# EAGLE design FT232RL_REEL (EAGLE 9.4.2)
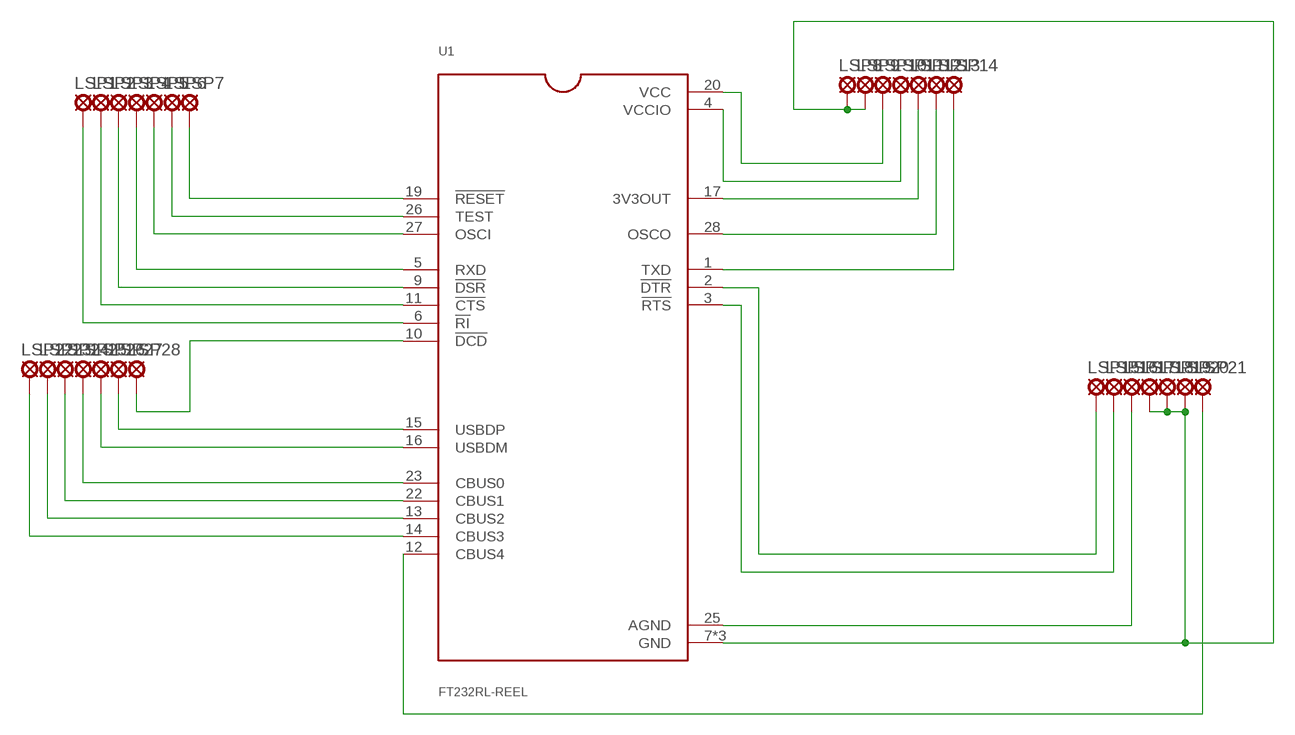
[diagram p0: schematic, sheet 1]

## Parts
LSP1  LSP10_CLSP10_C  [LSP10_C]
LSP2  LSP10_CLSP10_C  [LSP10_C]
LSP3  LSP10_CLSP10_C  [LSP10_C]
LSP4  LSP10_CLSP10_C  [LSP10_C]
LSP5  LSP10_CLSP10_C  [LSP10_C]
LSP6  LSP10_CLSP10_C  [LSP10_C]
LSP7  LSP10_CLSP10_C  [LSP10_C]
LSP8  LSP10_CLSP10_C  [LSP10_C]
LSP9  LSP10_CLSP10_C  [LSP10_C]
LSP10  LSP10_CLSP10_C  [LSP10_C]
LSP11  LSP10_CLSP10_C  [LSP10_C]
LSP12  LSP10_CLSP10_C  [LSP10_C]
LSP13  LSP10_CLSP10_C  [LSP10_C]
LSP14  LSP10_CLSP10_C  [LSP10_C]
LSP15  LSP10_CLSP10_C  [LSP10_C]
LSP16  LSP10_CLSP10_C  [LSP10_C]
LSP17  LSP10_CLSP10_C  [LSP10_C]
LSP18  LSP10_CLSP10_C  [LSP10_C]
LSP19  LSP10_CLSP10_C  [LSP10_C]
LSP20  LSP10_CLSP10_C  [LSP10_C]
LSP21  LSP10_CLSP10_C  [LSP10_C]
LSP22  LSP10_CLSP10_C  [LSP10_C]
LSP23  LSP10_CLSP10_C  [LSP10_C]
LSP24  LSP10_CLSP10_C  [LSP10_C]
LSP25  LSP10_CLSP10_C  [LSP10_C]
LSP26  LSP10_CLSP10_C  [LSP10_C]
LSP27  LSP10_CLSP10_C  [LSP10_C]
LSP28  LSP10_CLSP10_C  [LSP10_C]
U1  FT232RL-REEL  [SOP65P780X200-28N]

## Nets
N$1: LSP7.P$1(MP) U1.19(!RESET)
N$2: LSP6.P$1(MP) U1.26(TEST)
N$3: LSP5.P$1(MP) U1.27(OSCI)
N$4: LSP4.P$1(MP) U1.5(RXD)
N$5: LSP3.P$1(MP) U1.9(!DSR)
N$6: LSP2.P$1(MP) U1.11(!CTS)
N$7: LSP1.P$1(MP) U1.6(!RI)
N$8: LSP28.P$1(MP) U1.10(!DCD)
N$9: LSP27.P$1(MP) U1.15(USBDP)
N$10: LSP26.P$1(MP) U1.16(USBDM)
N$11: LSP25.P$1(MP) U1.23(CBUS0)
N$12: LSP24.P$1(MP) U1.22(CBUS1)
N$13: LSP23.P$1(MP) U1.13(CBUS2)
N$14: LSP22.P$1(MP) U1.14(CBUS3)
N$15: LSP21.P$1(MP) U1.12(CBUS4)
N$16: LSP8.P$1(MP) LSP9.P$1(MP) LSP18.P$1(MP) LSP19.P$1(MP) LSP20.P$1(MP) U1.7(GND) U1.18(GND) U1.21(GND)
N$17: LSP17.P$1(MP) U1.25(AGND)
N$18: LSP16.P$1(MP) U1.3(!RTS)
N$19: LSP15.P$1(MP) U1.2(!DTR)
N$20: LSP14.P$1(MP) U1.1(TXD)
N$21: LSP13.P$1(MP) U1.28(OSCO)
N$22: LSP12.P$1(MP) U1.17(3V3OUT)
N$23: LSP11.P$1(MP) U1.4(VCCIO)
N$24: LSP10.P$1(MP) U1.20(VCC)

## Library data of the parts
LSP1-LSP28 = tbtaco-solpad:LSP10_C: SOLDER PAD drill 1.0 mm, distributor Buerklin, 12H555
U1 = FT232RL-REEL:FT232RL-REEL: USB to serial UART interface; DESCRIPTION: USB Full Speed to Serial UART IC, Includes Oscillator and EEPROM - SSOP-28; DIGI-KEY_PART_NUMBER: 768-1007-1-ND; DIGI-KEY_PURCHASE_URL: https://www.digikey.com/product-detail/en/ftdi-future-technology-devices-international-ltd/FT232RL-REEL/768-1007-1-ND/1836402?utm_source=snapeda&utm_medium=aggregator&utm_campaign=symbol; MF: FTDI,; MP: FT232RL-REEL; PACKAGE: SSOP-28 FTDI

## Board
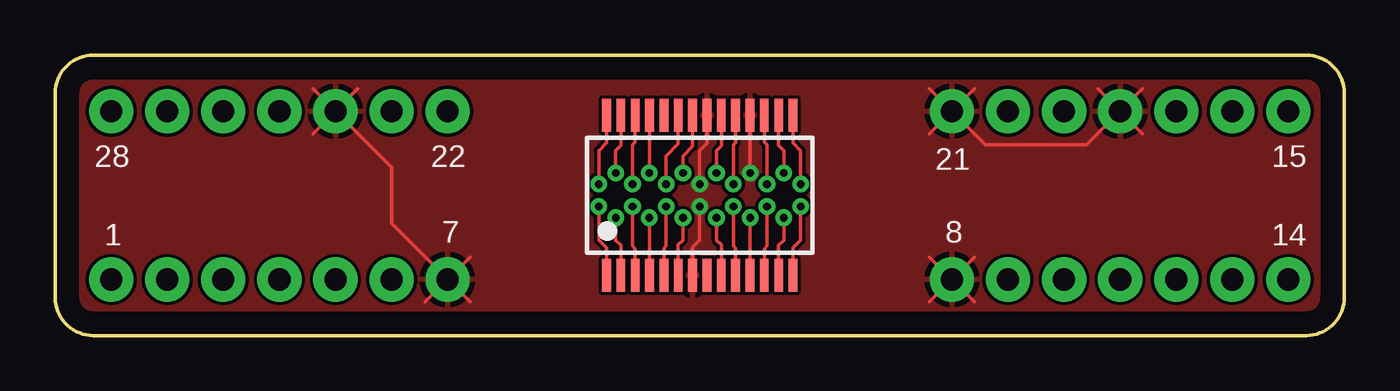
[diagram p1: board, top side]
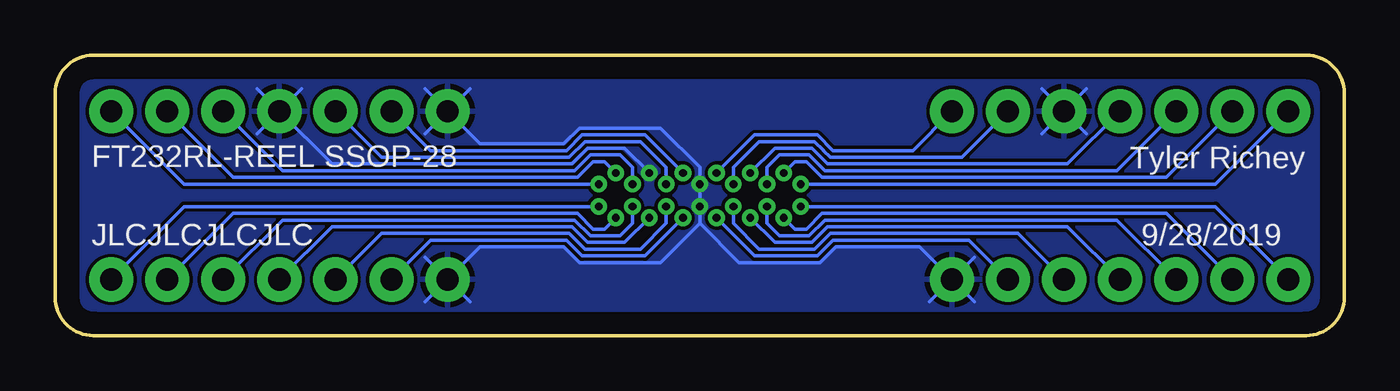
[diagram p2: board, bottom side, seen from below]

Size 58.42 x 12.7 mm. Coordinates in mm from the lower left corner, seen from the top.
Outline: 0,1.73 0,10.97 arc-90 1.73,12.7 56.69,12.7 arc-90 58.42,10.97 58.42,1.73 arc-90 56.69,0 1.73,0 arc-90 0,1.73
Copper layers (1*16): Top 0.035mm / dielectric 1.5mm / Bottom 0.035mm
Design rules "default": minimum track width 6mil, minimum drill 0.35mm, track to track 6mil, track to pad 6mil, pad to pad 6mil, via to via 6mil, smd to smd 6mil, copper to edge 40mil, drill to drill 6mil, minimum pad ring 10mil, minimum via ring 8mil, stop-mask expansion 4mil, vias tented up to drill 0mil, thermal gap 10mil

### Footprints (pad centres in the part's own frame; a part is rotated, then mirrored left to right if it is on the bottom)
LSP10_C = drill 1 pad 2: P$1 0,0
SOP65P780X200-28N = smd 1.5 x 0.4: 1 -3.625,4.225; 2 -3.625,3.575; 3 -3.625,2.925; 4 -3.625,2.275; 5 -3.625,1.625; 6 -3.625,0.975; 7 -3.625,0.325; 8 -3.625,-0.325; 9 -3.625,-0.975; 10 -3.625,-1.625; 11 -3.625,-2.275; 12 -3.625,-2.925; 13 -3.625,-3.575; 14 -3.625,-4.225; 15 3.625,-4.225; 16 3.625,-3.575; 17 3.625,-2.925; 18 3.625,-2.275; 19 3.625,-1.625; 20 3.625,-0.975; 21 3.625,-0.325; 22 3.625,0.325; 23 3.625,0.975; 24 3.625,1.625; 25 3.625,2.275; 26 3.625,2.925; 27 3.625,3.575; 28 3.625,4.225

### Placement (x,y rotation side)
LSP1  15.24,2.54 0 top
LSP2  48.26,2.54 0 top
LSP3  43.18,2.54 0 top
LSP4  12.7,2.54 0 top
LSP5  5.08,10.16 0 top
LSP6  7.62,10.16 0 top
LSP7  45.72,10.16 0 top
LSP8  12.7,10.16 0 top
LSP9  17.78,2.54 0 top
LSP10  43.18,10.16 0 top
LSP11  10.16,2.54 0 top
LSP12  50.8,10.16 0 top
LSP13  2.54,10.16 0 top
LSP14  2.54,2.54 0 top
LSP15  5.08,2.54 0 top
LSP16  7.62,2.54 0 top
LSP17  10.16,10.16 0 top
LSP18  48.26,10.16 0 top
LSP19  40.64,10.16 0 top
LSP20  40.64,2.54 0 top
LSP21  50.8,2.54 0 top
LSP22  55.88,2.54 0 top
LSP23  53.34,2.54 0 top
LSP24  17.78,10.16 0 top
LSP25  15.24,10.16 0 top
LSP26  53.34,10.16 0 top
LSP27  55.88,10.16 0 top
LSP28  45.72,2.54 0 top
U1  29.21,6.35 90 top

### Tracks (layer width: path | path; a pad name or v marks a point on that pad's centre or on a via)
N$1  (via drill 0.35)
  Top 0.152: U1.19 30.83,8.74 30.73,8.64 v30.73,6.86
  Bottom 0.152: v30.73,6.86 30.73,7.62 31.9,8.79 34.41,8.79 35.13,8.08 43.64,8.08 LSP7.P$1
N$2  (via drill 0.35)
  Top 0.152: U1.26 26.29,8.76 26.16,8.64 v26.16,6.86
  Bottom 0.152: LSP6.P$1 10.31,7.47 21.08,7.47 21.34,7.47 23.55,7.47 24.26,8.18 25.6,8.18 26.16,7.62 v26.16,6.86
N$3  (via drill 0.35)
  Top 0.152: U1.27 25.64,8.62 25.4,8.38 v25.4,7.37
  Bottom 0.152: LSP5.P$1 8.08,7.16 23.67,7.16 24.38,7.87 24.89,7.87 v25.4,7.37
N$4  (via drill 0.35)
  Top 0.152: U1.5 27.58,3.96 27.69,4.06 v27.69,5.84
  Bottom 0.152: LSP4.P$1 14.78,4.62 23.29,4.62 24,3.91 26.52,3.91 27.69,5.08 v27.69,5.84
N$5  (via drill 0.35)
  Top 0.152: U1.9 30.18,4.11 29.97,4.32 v29.97,5.33
  Bottom 0.152: v29.97,5.33 31.7,3.61 34.54,3.61 35.25,4.32 41.4,4.32 LSP3.P$1
N$6  (via drill 0.35)
  Top 0.152: U1.11 31.48,4.05 31.5,4.06 v31.5,5.33
  Bottom 0.152: v31.5,5.33 32.61,4.22 34.29,4.22 35,4.93 45.87,4.93 LSP2.P$1
N$7  (via drill 0.35)
  Top 0.152: U1.6 28.23,4.11 28.45,4.32 v28.45,5.33
  Bottom 0.152: LSP1.P$1 17.02,4.32 23.17,4.32 23.88,3.61 26.72,3.61 v28.45,5.33
N$8  (via drill 0.35)
  Top 0.152: U1.10 30.83,3.96 30.73,4.06 v30.73,5.84
  Bottom 0.152: v30.73,5.84 30.73,5.08 31.9,3.91 34.41,3.91 35.13,4.62 43.64,4.62 LSP28.P$1
N$9  (via drill 0.35)
  Top 0.152: U1.15 33.44,8.73 33.78,8.38 v33.78,6.86
  Bottom 0.152: v33.78,6.86 52.58,6.86 LSP27.P$1
N$10  (via drill 0.35)
  Top 0.152: U1.16 32.79,8.62 33.02,8.38 v33.02,7.37
  Bottom 0.152: LSP26.P$1 50.34,7.16 34.75,7.16 34.04,7.87 33.53,7.87 v33.02,7.37
N$11  (via drill 0.35)
  Top 0.152: U1.23 28.23,8.68 27.69,8.13 v27.69,6.86
  Bottom 0.152: v27.69,6.86 27.69,7.62 26.52,8.79 24,8.79 23.61,8.39 23.6,8.38 23.29,8.08 17.32,8.08 LSP25.P$1
N$12  (via drill 0.35)
  Top 0.152: U1.22 28.89,8.57 28.45,8.13 v28.45,7.37
  Bottom 0.152: LSP24.P$1 19.56,8.38 23.17,8.38 23.88,9.09 26.72,9.09 v28.45,7.37
N$13  (via drill 0.35)
  Top 0.152: U1.13 32.79,4.08 33.02,4.32 v33.02,5.33
  Bottom 0.152: v33.02,5.33 33.53,4.83 34.04,4.83 34.75,5.54 50.34,5.54 LSP23.P$1
N$14  (via drill 0.35)
  Top 0.152: U1.14 33.44,3.97 33.78,4.32 v33.78,5.84
  Bottom 0.152: LSP22.P$1 52.58,5.84 v33.78,5.84
N$15  (via drill 0.35)
  Top 0.152: U1.12 32.14,3.94 32.26,4.06 v32.26,5.84
  Bottom 0.152: v32.26,5.84 32.26,5.08 32.82,4.52 34.16,4.52 34.87,5.23 48.11,5.23 LSP21.P$1
N$16  (via drill 0.35)
  Top 0.152: U1.21 29.54,8.71 29.21,8.38 v29.21,6.86 | U1.18 31.48,8.65 31.5,8.64 v31.5,7.37 | U1.7 28.89,3.99 29.21,4.32 v29.21,5.84 | LSP19.P$1 42.16,8.64 46.74,8.64 LSP18.P$1 | LSP8.P$1 15.24,7.62 15.24,5.08 LSP9.P$1 | LSP8.P$1 13.72,11.18 | LSP8.P$1 11.68,11.18 | LSP8.P$1 11.68,9.14 | LSP9.P$1 18.8,3.56 | LSP9.P$1 18.8,1.52 | LSP9.P$1 16.76,1.52 | LSP19.P$1 39.62,11.18 | LSP19.P$1 41.66,11.18 | LSP19.P$1 39.62,9.14 | LSP18.P$1 47.24,11.18 | LSP18.P$1 49.28,11.18 | LSP18.P$1 49.28,9.14 | LSP20.P$1 39.62,3.56 | LSP20.P$1 41.66,3.56 | LSP20.P$1 41.66,1.52 | LSP20.P$1 39.62,1.52
  Bottom 0.152: v31.5,7.37 32.61,8.48 34.29,8.48 35,7.77 45.87,7.77 LSP18.P$1 | LSP19.P$1 39.17,8.69 35.38,8.69 34.67,9.4 30.99,9.4 29.21,7.62 v29.21,6.86 v29.21,5.84 29.21,5.08 | LSP20.P$1 39.17,4.01 35.38,4.01 34.67,3.3 30.99,3.3 29.21,5.08 | LSP9.P$1 19.25,4.01 23.04,4.01 23.75,3.3 27.43,3.3 29.21,5.08 | LSP8.P$1 13.72,11.18 | LSP8.P$1 11.68,11.18 | LSP8.P$1 11.68,9.14 | LSP8.P$1 13.72,9.14 | LSP9.P$1 16.76,3.56 | LSP9.P$1 16.76,1.52 | LSP9.P$1 18.8,1.52 | LSP19.P$1 41.66,9.14 | LSP19.P$1 41.66,11.18 | LSP19.P$1 39.62,11.18 | LSP20.P$1 41.66,3.56 | LSP20.P$1 41.66,1.52 | LSP20.P$1 39.62,1.52 | LSP18.P$1 47.24,11.18 | LSP18.P$1 49.28,11.18 | LSP18.P$1 49.28,9.14
  pour Top: 0,1.73 0,10.97 arc-90 1.73,12.7 56.69,12.7 arc-90 58.42,10.97 58.42,1.73 arc-90 56.69,0 1.73,0 arc-90
  pour Bottom: 56.69,12.7 1.73,12.7 arc90 0,10.97 0,1.73 arc90 1.73,0 56.69,0 arc90 58.42,1.73 58.42,10.97 arc90
N$17  (via drill 0.35)
  Top 0.152: U1.25 26.93,8.65 26.92,8.64 v26.92,7.37
  Bottom 0.152: LSP17.P$1 12.55,7.77 20.83,7.77 21.08,7.77 23.42,7.77 24.13,8.48 25.81,8.48 v26.92,7.37
N$18  (via drill 0.35)
  Top 0.152: U1.3 26.29,3.94 26.16,4.06 v26.16,5.84
  Bottom 0.152: LSP16.P$1 10.31,5.23 23.55,5.23 24.26,4.52 25.6,4.52 26.16,5.08 v26.16,5.84
N$19  (via drill 0.35)
  Top 0.152: U1.2 25.64,4.08 25.4,4.32 v25.4,5.33
  Bottom 0.152: LSP15.P$1 8.08,5.54 23.67,5.54 24.38,4.83 24.89,4.83 v25.4,5.33
N$20  (via drill 0.35)
  Top 0.152: 24.98,3.21 U1.1 24.98,3.97 24.64,4.32 v24.64,5.84
  Bottom 0.152: v24.64,5.84 5.84,5.84 LSP14.P$1
N$21  (via drill 0.35)
  Top 0.152: 24.98,9.49 U1.28 24.98,8.73 24.64,8.38 v24.64,6.86
  Bottom 0.152: v24.64,6.86 5.84,6.86 LSP13.P$1
N$22  (via drill 0.35)
  Top 0.152: U1.17 32.14,8.76 32.26,8.64 v32.26,6.86
  Bottom 0.152: v32.26,6.86 32.26,7.62 32.82,8.18 34.16,8.18 34.87,7.47 48.11,7.47 LSP12.P$1
N$23  (via drill 0.35)
  Top 0.152: U1.4 26.93,4.05 26.92,4.06 v26.92,5.33
  Bottom 0.152: LSP11.P$1 12.55,4.93 23.42,4.93 24.13,4.22 25.81,4.22 v26.92,5.33
N$24  (via drill 0.35)
  Top 0.152: U1.20 30.18,8.6 29.97,8.38 v29.97,7.37
  Bottom 0.152: v29.97,7.37 31.7,9.09 34.54,9.09 35.25,8.38 41.4,8.38 LSP10.P$1

### Text on the board
tPlace: 28 | 22 | 21 | 15 | 1 | 7 | 8 | 14
bPlace: Tyler Richey | FT232RL-REEL SSOP-28 | 9/28/2019 | JLCJLCJLCJLC